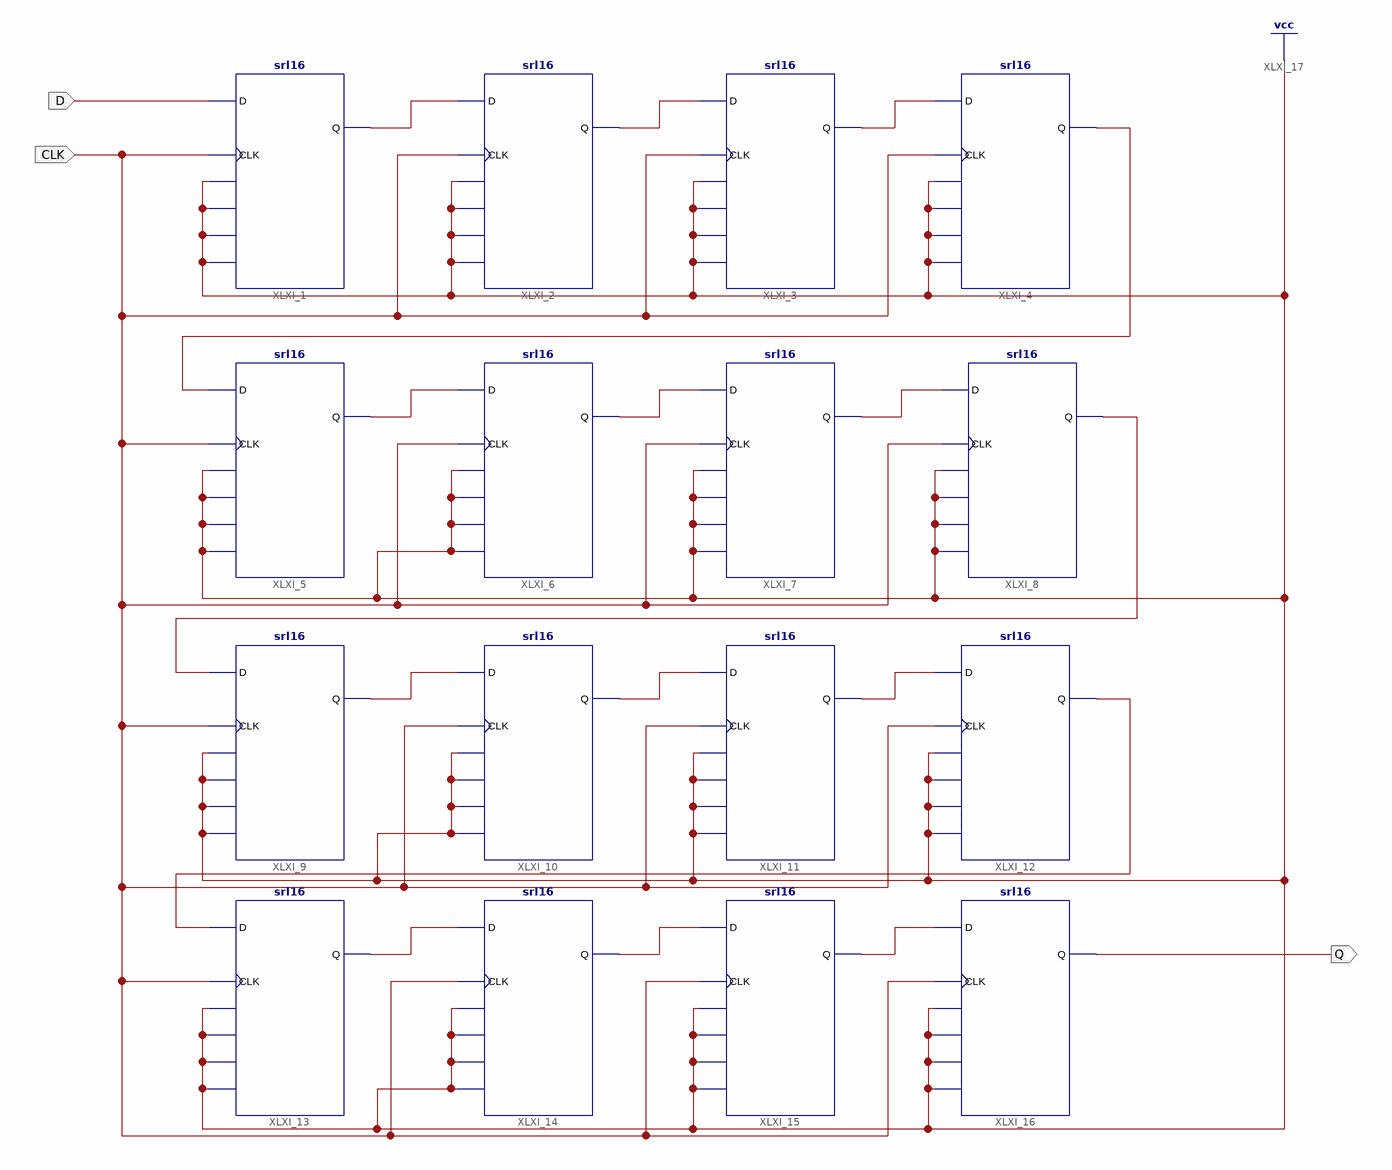
[diagram p0: schematic sheet 1]
// Xilinx ISE schematic shift_reg128.sch (spartan3a) as structural Verilog: 16 symbols, 3 ports
module shift_reg128 (
  input  D,
  input  CLK,
  output Q
);

  wire XLXN_4, XLXN_5, XLXN_6, XLXN_7, XLXN_9, XLXN_10, XLXN_11, XLXN_12, XLXN_13, XLXN_14, XLXN_15, XLXN_16,
       XLXN_17, XLXN_18, XLXN_19;

  srl16 XLXI_1 (.A0(1'b1), .A1(1'b1), .A2(1'b1), .A3(1'b1), .CLK(CLK), .D(D), .Q(XLXN_4));
  srl16 XLXI_2 (.A0(1'b1), .A1(1'b1), .A2(1'b1), .A3(1'b1), .CLK(CLK), .D(XLXN_4), .Q(XLXN_5));
  srl16 XLXI_3 (.A0(1'b1), .A1(1'b1), .A2(1'b1), .A3(1'b1), .CLK(CLK), .D(XLXN_5), .Q(XLXN_6));
  srl16 XLXI_4 (.A0(1'b1), .A1(1'b1), .A2(1'b1), .A3(1'b1), .CLK(CLK), .D(XLXN_6), .Q(XLXN_7));
  srl16 XLXI_5 (.A0(1'b1), .A1(1'b1), .A2(1'b1), .A3(1'b1), .CLK(CLK), .D(XLXN_7), .Q(XLXN_9));
  srl16 XLXI_6 (.A0(1'b1), .A1(1'b1), .A2(1'b1), .A3(1'b1), .CLK(CLK), .D(XLXN_9), .Q(XLXN_10));
  srl16 XLXI_7 (.A0(1'b1), .A1(1'b1), .A2(1'b1), .A3(1'b1), .CLK(CLK), .D(XLXN_10), .Q(XLXN_11));
  srl16 XLXI_8 (.A0(1'b1), .A1(1'b1), .A2(1'b1), .A3(1'b1), .CLK(CLK), .D(XLXN_11), .Q(XLXN_12));
  srl16 XLXI_9 (.A0(1'b1), .A1(1'b1), .A2(1'b1), .A3(1'b1), .CLK(CLK), .D(XLXN_12), .Q(XLXN_13));
  srl16 XLXI_10 (.A0(1'b1), .A1(1'b1), .A2(1'b1), .A3(1'b1), .CLK(CLK), .D(XLXN_13), .Q(XLXN_14));
  srl16 XLXI_11 (.A0(1'b1), .A1(1'b1), .A2(1'b1), .A3(1'b1), .CLK(CLK), .D(XLXN_14), .Q(XLXN_15));
  srl16 XLXI_12 (.A0(1'b1), .A1(1'b1), .A2(1'b1), .A3(1'b1), .CLK(CLK), .D(XLXN_15), .Q(XLXN_16));
  srl16 XLXI_13 (.A0(1'b1), .A1(1'b1), .A2(1'b1), .A3(1'b1), .CLK(CLK), .D(XLXN_16), .Q(XLXN_17));
  srl16 XLXI_14 (.A0(1'b1), .A1(1'b1), .A2(1'b1), .A3(1'b1), .CLK(CLK), .D(XLXN_17), .Q(XLXN_18));
  srl16 XLXI_15 (.A0(1'b1), .A1(1'b1), .A2(1'b1), .A3(1'b1), .CLK(CLK), .D(XLXN_18), .Q(XLXN_19));
  srl16 XLXI_16 (.A0(1'b1), .A1(1'b1), .A2(1'b1), .A3(1'b1), .CLK(CLK), .D(XLXN_19), .Q(Q));
endmodule
